# Altium schematic sheet Variable Output 2.SchDoc
size A4
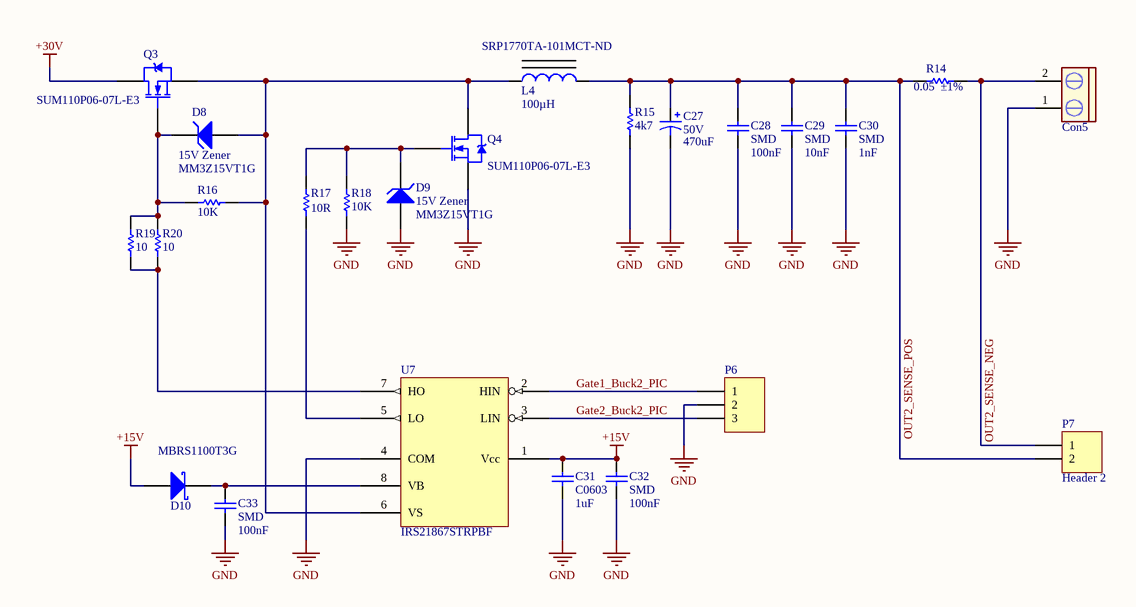
[diagram p0: Variable Output 2.SchDoc]

## Parts
C27  50V  value 470uF  [CAPPR5-10X20]
C28  SMD  value 100nF  [1206]
C29  SMD  value 10nF  [1206]
C30  SMD  value 1nF  [1206]
C31  C0603  value 1uF  [0603]
C32  SMD  value 100nF  [1206]
C33  SMD  value 100nF  [1206]
Con5  Salida Buck  [My_CN2]  (value not drawn)
D8  15V Zener  Manufacturer Part Number: MM3Z15VT1G  [SOD323]
D9  15V Zener  Manufacturer Part Number: MM3Z15VT1G  [SOD323]
D10  MBRS1100T3G  [SMB]
L4  Supplier Part Number: SRP1770TA-101MCT-ND  Inductance: 100µH  [SRP1770TA Series]  (hidden comment: Ferrite Inductor)
P6  Header 3  [My_1X03]  (value not drawn)
P7  Header 2  [HDR1X2]
Q3  Manufacturer Part Number: SUM110P06-07L-E3  [D2PAK_N]  (hidden comment: SUM110P06)
Q4  Manufacturer Part Number: SUM110P06-07L-E3  [D2PAK_N]  (hidden comment: SUM110P06)
R14  Resistance (Ohms): 0.05  Tolerance: ±1%  [L1W-2512]  (hidden comment: ERJL1W)
R15  value 4k7  [8RB-1206]  (hidden comment: SMD)
R16  10K  [ERA-0603]
R17  value 10R  [8RB-1206]  (hidden comment: SMD 1206)
R18  10K  [ERA-0603]
R19  10  [ERA-0603]
R20  10  [ERA-0603]
U7  Manufacturer Part Number: IRS21867STRPBF  [SOIC8]  (hidden comment: IRS21867S)

## Nets
+15V: C31.2 C32.2 D10.1(A) U7.1(Vcc)
+30V: Q3.2(D)
GND: C27.2 C28.1 C29.1 C30.1 C31.1 C32.1 C33.1 Con5.1 D9.1(A) P6.2 Q4.3(S) R15.1 R18.1 U7.4(COM)
Gate1_Buck2_PIC: P6.1 U7.2(HIN)
Gate2_Buck2_PIC: P6.3 U7.3(LIN)
OUT2_SENSE_NEG: Con5.2 P7.1 R14.2
OUT2_SENSE_POS: C27.1 C28.2 C29.2 C30.2 L4.2 P7.2 R14.1 R15.2
NetC33_2: C33.2 D10.2(K) U7.8(VB)
NetD8_1: D8.1(A) L4.1 Q3.3(S) Q4.2(D) R16.2 U7.6(VS)
NetD8_2: D8.2(K) Q3.1(G) R16.1 R19.2 R20.2
NetD9_2: D9.2(K) Q4.1(G) R17.1 R18.2
NetR17_2: R17.2 U7.5(LO)
NetR19_1: R19.1 R20.1 U7.7(HO)

## Library data of the parts
C27 = EKB00DE347H00: Aluminum Electrolytic Capacitor, Radial Style with Long Leads: 470uF, 50V; Note: Refer to Manufacturer's Data Sheets for other lead formations; DrillSize: Nominal, Rounded To The Nearest 0.1mm; Published: 19-Mar-2004; DatasheetDocument: 21-Feb-2001; PackageReference: CAPPR5-10X20; Publisher: Altium Limited; ComponentLink1Description: Manufacturer Link; ComponentLink1URL: http://www.vishay.com/; ComponentLink2Description: Datasheet; ComponentLink2URL: http://www.vishay.com/docs/25013/ekb.pdf
C28-C30 C32 C33 = C1206: Ceramic Chip Capacitor - Standard; Published: 17-Jul-2002; LatestRevisionDate: 19-Mar-2004; LatestRevisionNote: Silkscreen size reduced.; DatasheetDocument: Mar-2001; PackageDocument: Mar-2001; PackageReference: 1206; Publisher: Altium Limited; Code_JEITA: 1206; Code_IPC: 3216 [1206]; ComponentLink1Description: Manufacturer Link; ComponentLink1URL: http://www.kemet.com/; ComponentLink2Description: Datasheet; ComponentLink2URL: http://www.kemet.com/kemet/web/homepage/kechome.nsf/vapubfilesname/F3102TA.pdf/$file/F3102TA.pdf
C31 = C0603: C1608X7R1C105K X7R; Note: Footprint corresponds to dimensions for bulk cassette packaging. This case size has tightened tolerances.; Published: 17-Jul-2002; LatestRevisionDate: 19-Mar-2004; LatestRevisionNote: Silkscreen size reduced.; DatasheetDocument: Mar-2001; PackageDocument: Mar-2001; PackageReference: 0603; Publisher: Altium Limited; Code_JEITA: 0603; Code_IPC: 1608 [0603]; ComponentLink1Description: Manufacturer Link; ComponentLink1URL: http://www.kemet.com/; ComponentLink2Description: Datasheet; ComponentLink2URL: http://www.kemet.com/kemet/web/homepage/kechome.nsf/vapubfilesname/F3102TA.pdf/$file/F3102TA.pdf
Con5 = CON2 pin blue: Connector blue screw
D8 D9 = D Zener: Zener Diode; Manufacturer: ON Semiconductor; Current - Reverse Leakage @ Vr: 50nA @ 10.5V; Voltage - Forward (Vf) (Max) @ If: 900mV @ 10mA; Tolerance: ±5%; Power - Max: 300mW; Packaging: Cut Tape (CT); Operating Temperature: -65°C ~ 150°C; Supplier Device Package: SOD-323; Mounting Type: Surface Mount; Supplier: Digi-Key; Supplier Part Number: MM3Z15VT1GOSCT-ND; RoHS: RoHS Compliant; Package / Case: SC-76, SOD-323; Category: Discrete Semiconductor Products; Part Status: Active
D10 = Generic Schottky Diode
L4 = Ferrite Inductor: Manufacturer Part Number: SRP1770TA-101M; Manufacturer: Bourns Inc.; Value: 100uH; Tolerance: ±20%; Type: Wirewound; DC Resistance (DCR): 118 mOhm Max; Current Rating: 5.3A; Current - Saturation: 6.5A; Shielding: Shielded; Material - Core: Carbonyl Powder; Frequency - Self Resonant: 2MHz; Q @ Freq: 20 @ 100kHz; Supplier Device Package: -; Package / Case: Nonstandard; Operating Temperature: -40°C ~ 150°C; Mounting Type: Surface Mount; Height - Seated (Max): 0.276" (7.00mm); Size / Dimension: 0.666" L x 0.666" W (16.90mm x 16.90mm); Part Status: Active; Ratings: AEC-Q200; Category: Inductors, Coils, Chokes; Packaging: Cut Tape (CT); RoHS: RoHS Compliant; Supplier: Digi-Key
P6 = Header 3: Header, 3-Pin; LatestRevisionDate: 17-Jul-2002; LatestRevisionNote: Re-released for DXP Platform.; Publisher: Altium Limited
P7 = Header 2: Header, 2-Pin; LatestRevisionDate: 17-Jul-2002; LatestRevisionNote: Re-released for DXP Platform.; Publisher: Altium Limited
Q3 Q4 = IRF540NS: HEXFET Power MOSFET; Manufacturer: Vishay Siliconix; Vgs (Max): ±20V; Rds On (Max) @ Id, Vgs: 6.9 mOhm @ 30A, 10V; Vgs(th) (Max) @ Id: 3V @ 250µA; Power Dissipation (Max): 3.75W (Ta), 375W (Tc); Input Capacitance (Ciss) (Max) @ Vds: 11400pF @ 25V; Gate Charge (Qg) (Max) @ Vgs: 345nC @ 10V; Current - Continuous Drain (Id) @ 25°C: 110A (Tc); Drive Voltage (Max Rds On,  Min Rds On): 4.5V, 10V; FET Type: P-Channel; Drain to Source Voltage (Vdss): 60V; Supplier Device Package: TO-263 (D2Pak); FET Feature: -; Mounting Type: Surface Mount; Package / Case: TO-263-3, D²Pak (2 Leads + Tab), TO-263AB; Operating Temperature: -55°C ~ 175°C (TJ); Supplier: Digi-Key; Packaging: Cut Tape (CT); Category: Discrete Semiconductor Products; RoHS: RoHS Compliant; Technology: MOSFET (Metal Oxide); Part Status: Active; Supplier Part Number: SUM110P06-07L-E3CT-ND
R14 = ERJL1W: Low Ohmic Value Thick Film Chip Resistor, 40m Ohm to 100m Ohm Range, 1% and 5% Tolerance, 2512 Size, 1 W; Manufacturer Part Number: PE2512FKE070R05L; Manufacturer: Yageo; Power (Watts): 1W; Temperature Coefficient: ±50ppm/°C; Published: 17-Dec-2003; LatestRevisionDate: 19-Mar-2004; LatestRevisionNote: Silkscreen size reduced.; PackageDocument: Mar-2003; PackageReference: L1W-2512; Publisher: Altium Limited; ComponentLink1Description: Manufacturer Link; ComponentLink1URL: http://www.panasonic.com/industrial/components/resistive_products.htm; ComponentLink2Description: Datasheet; ComponentLink2URL: http://www.panasonic.com/industrial/components/pdf/AOA0000CE3.pdf; Features: Automotive AEC-Q200, Current Sense, Moisture Resistant; Supplier: Digi-Key; Package / Case: 2512 (6432 Metric); RoHS: RoHS Compliant; Height - Seated (Max): 0.035" (0.89mm); Size / Dimension: 0.250" L x 0.125" W (6.35mm x 3.18mm); Supplier Device Package: 2512; Part Status: Active; Packaging: Cut Tape (CT); Operating Temperature: -55°C ~ 170°C; Composition: Metal Film; Category: Resistors; Failure Rate: -; Supplier Part Number: YAG2156CT-ND
R15 R17 = ERJ8BQ: Low Ohmic Value Thick Film Chip Resistor, 0.22 Ohm to 9.1 Ohm Range, 1%, 2% and 5% Tolerance, 1206 Size, 0.33 W; Published: 17-Dec-2003; LatestRevisionDate: 19-Mar-2004; LatestRevisionNote: Silkscreen size reduced.; PackageDocument: Mar-2003; PackageReference: 8RB-1206; Publisher: Altium Limited; Code_IPC: 3216 [1206]; ComponentLink1Description: Manufacturer Link; ComponentLink1URL: http://www.panasonic.com/industrial/components/resistive_products.htm; ComponentLink2Description: Datasheet; ComponentLink2URL: http://www.panasonic.com/industrial/components/pdf/AOA0000CE3.pdf
R16 R18-R20 = ERA3Y: Rectangular Thick Film Chip Resistor, 10 Ohm to 330k Ohm Range, 0.1% and 0.5% Tolerance, 0603 Size, 0.063 W; Note: If flow soldering, adjust pad width of PCB Footprint to 0.7 - 0.8 times the width of the resistor.; Published: 17-Dec-2003; LatestRevisionDate: 19-Mar-2004; LatestRevisionNote: Silkscreen size reduced.; PackageDocument: Mar-2003; PackageReference: ERA-0603; Publisher: Altium Limited; Code_IPC: 1608 [0603]; ComponentLink1Description: Manufacturer Link; ComponentLink1URL: http://www.panasonic.com/industrial/components/resistive_products.htm; ComponentLink2Description: Datasheet; ComponentLink2URL: http://www.panasonic.com/industrial/components/pdf/AOA0000CE8.pdf
U7 = IRS21867S: Half-Bridge Gate Driver IC Inverting 8-SOIC; Manufacturer: Infineon Technologies; Gate Type: IGBT, N-Channel MOSFET; Current - Peak Output (Source, Sink): 4A, 4A; Voltage - Supply: 10 V ~ 20 V; Rise / Fall Time (Typ): 22ns, 18ns; Channel Type: Independent; Logic Voltage - VIL, VIH: 0.8V, 2.5V; Part Status: Active; Supplier: Digi-Key; Supplier Device Package: 8-SOIC; Package / Case: 8-SOIC (0.154", 3.90mm Width); Mounting Type: Surface Mount; Operating Temperature: -40°C ~ 150°C (TJ); Packaging: Cut Tape (CT); Input Type: Inverting; Category: Integrated Circuits (ICs); RoHS: RoHS Compliant; Driven Configuration: Half-Bridge; Supplier Part Number: IRS21867STRPBFCT-ND